# EAGLE design 7segement4digits1badidea-many-digits-mk-2 (EAGLE 6.5.0)
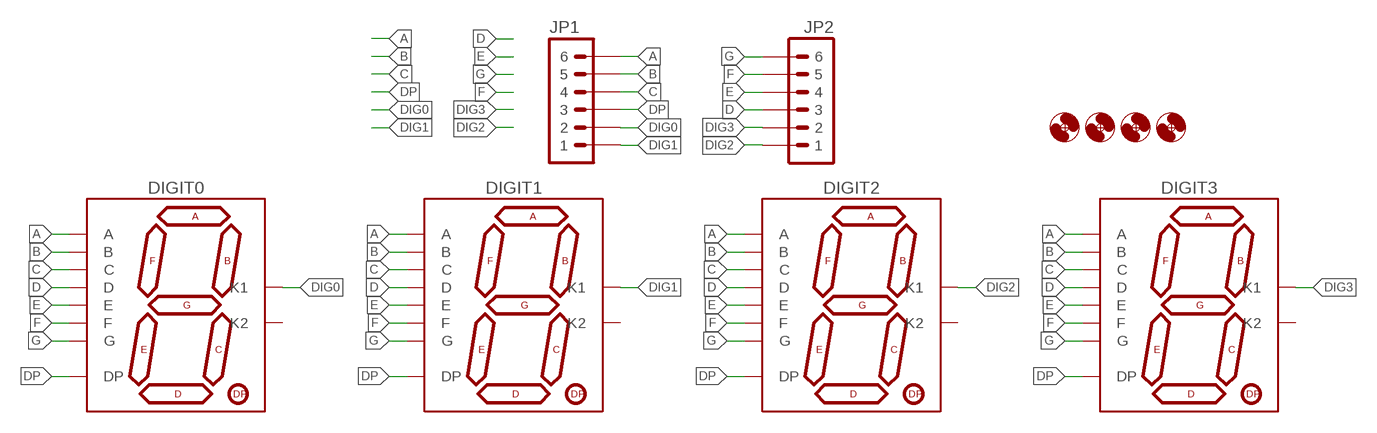
[diagram p0: schematic, sheet 1]

## Parts
DIGIT0  7SEG_1DIGPTH-25.4MM  [7SEG_1DIG_25.4MM]
DIGIT1  7SEG_1DIGPTH-25.4MM  [7SEG_1DIG_25.4MM]
DIGIT2  7SEG_1DIGPTH-25.4MM  [7SEG_1DIG_25.4MM]
DIGIT3  7SEG_1DIGPTH-25.4MM  [7SEG_1DIG_25.4MM]
H1  HOLE#2  [HOLE-#2]
H2  HOLE#2  [HOLE-#2]
H3  HOLE#2  [HOLE-#2]
H4  HOLE#2  [HOLE-#2]
JP1  M06-NOBS-PTH  [1X06_NOLOCK_FUCKITALL]
JP2  M06-NOBS-PTH  [1X06_NOLOCK_FUCKITALL]

## Nets
A: DIGIT0.7(A) DIGIT1.7(A) DIGIT2.7(A) DIGIT3.7(A) JP1.6
B: DIGIT0.6(B) DIGIT1.6(B) DIGIT2.6(B) DIGIT3.6(B) JP1.5
C: DIGIT0.4(C) DIGIT1.4(C) DIGIT2.4(C) DIGIT3.4(C) JP1.4
D: DIGIT0.2(D) DIGIT1.2(D) DIGIT2.2(D) DIGIT3.2(D) JP2.3
DIG0: DIGIT0.3(K1) JP1.2
DIG1: DIGIT1.3(K1) JP1.1
DIG2: DIGIT2.3(K1) JP2.1
DIG3: DIGIT3.3(K1) JP2.2
DP: DIGIT0.5(DP) DIGIT1.5(DP) DIGIT2.5(DP) DIGIT3.5(DP) JP1.3
E: DIGIT0.1(E) DIGIT1.1(E) DIGIT2.1(E) DIGIT3.1(E) JP2.4
F: DIGIT0.9(F) DIGIT1.9(F) DIGIT2.9(F) DIGIT3.9(F) JP2.5
G: DIGIT0.10(G) DIGIT1.10(G) DIGIT2.10(G) DIGIT3.10(G) JP2.6
Unconnected: DIGIT0.8(K2) DIGIT1.8(K2) DIGIT2.8(K2) DIGIT3.8(K2)

## Library data of the parts
DIGIT0 DIGIT1-DIGIT3 = A_butts:7SEG_1DIG
H1-H4 = A_butts:HOLE: MOUNTING HOLE with drill center marker
JP1 JP2 = A_butts:M06: Header 6 Standard 6-pin 0.1" header. Use with straight break away headers (SKU : PRT-00116), right angle break away headers (PRT-00553), swiss pins (PRT-00743), machine pins (PRT-00117), and female headers (PRT-00115). Molex polarized connector foot print use with SKU : PRT-08094 with associated crimp pins and housings. NOTES ON THE VARIANTS LOCK and LOCK_LONGPADS... This footprint was designed to help hold the alignment of a through-hole component (i.e. 6-pin header) while soldering it into place. You may notice that each hole has been shifted either up or down by 0.005 of an inch from it's more standard position (which is a perfectly straight line). This slight alteration caused the pins (the squares in the middle) to touch the edges of the holes. Because they are alternating, it causes a "brace" to hold the component in place. 0.005 has proven to be the perfect amount of "off-center" position when using our standard breakaway headers. Although looks a little odd when you look at the bare footprint, once you have a header in there, the alteration is very hard to notice. Also,if you push a header all the way into place, it is covered up entirely on the bottom side. This idea of altering the position of holes to aid alignment will be further integrated into the Sparkfun Library for other footprints. It can help hold any component with 3 or more connection pins.

## Board
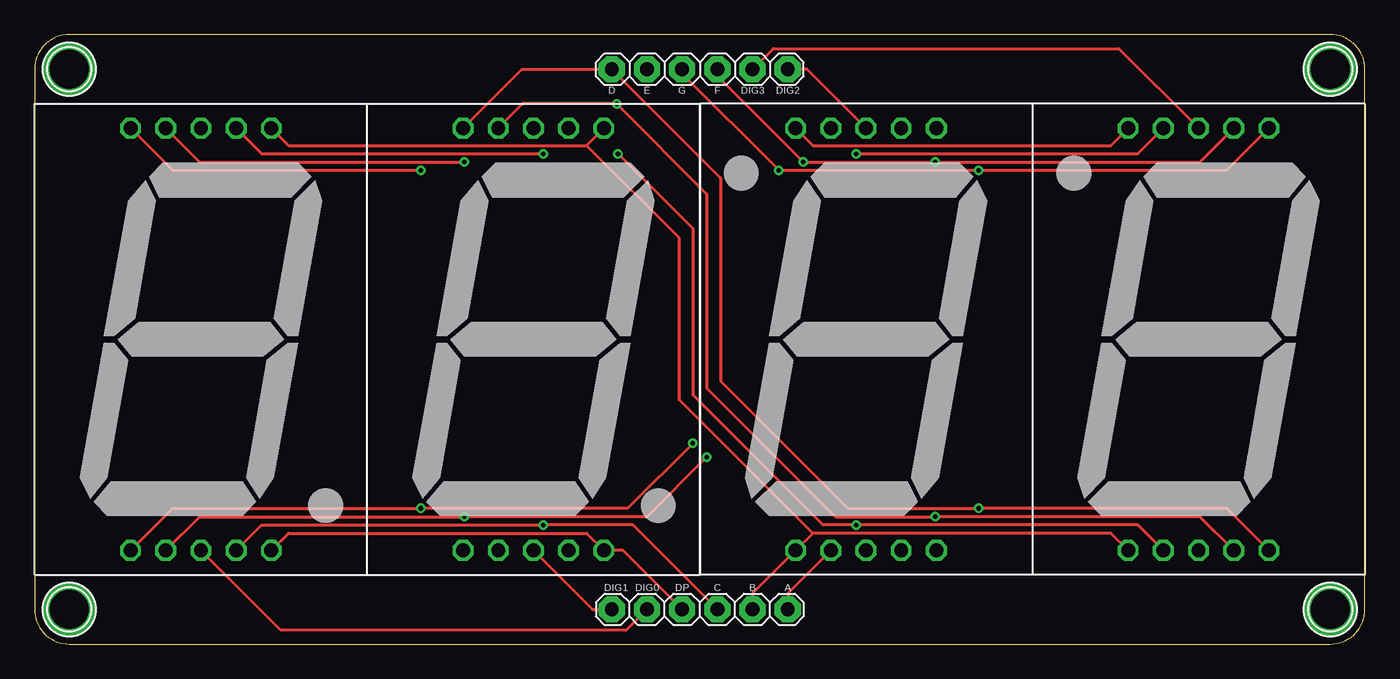
[diagram p1: board, top side]
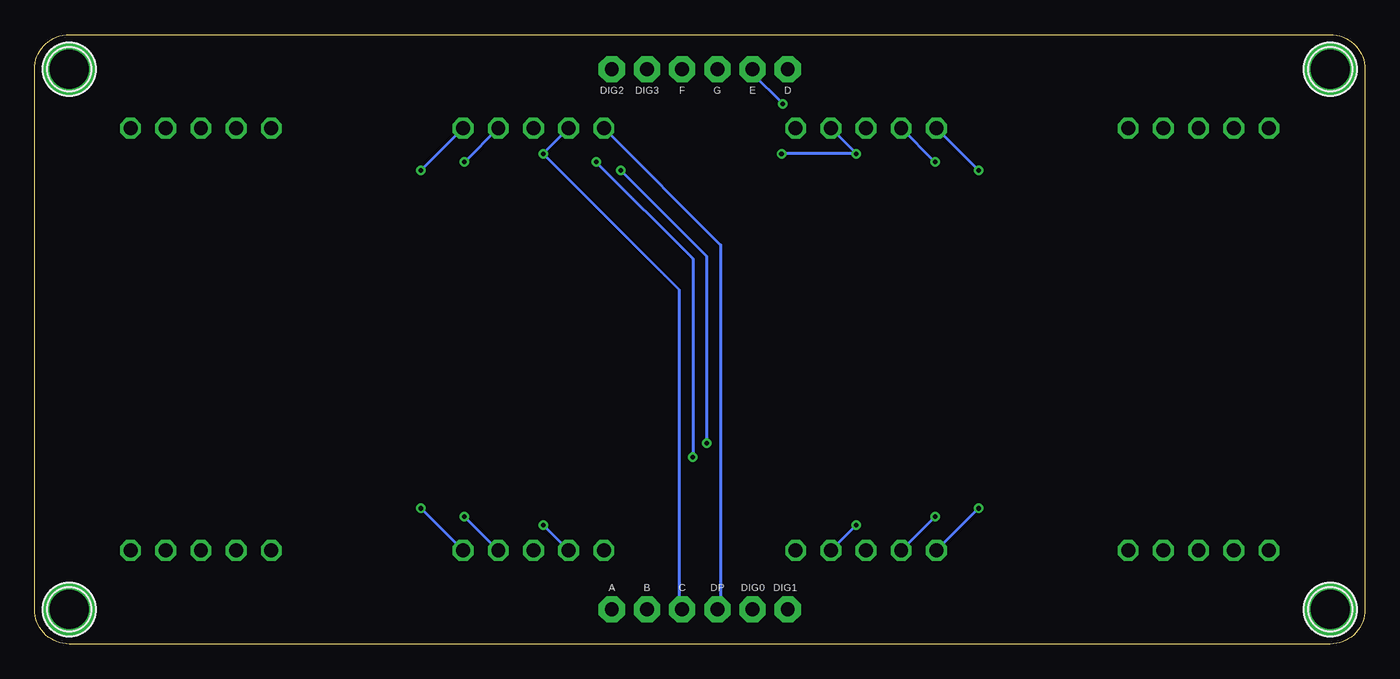
[diagram p2: board, bottom side, seen from below]

Size 96 x 44 mm. Coordinates in mm from the lower left corner, seen from the top.
Outline: 2.5,0 93.5,0 arc90 96,2.5 96,41.5 arc90 93.5,44 2.5,44 arc90 0,41.5 0,2.5 arc90 2.5,0
Copper layers (1*16): Top 0.0356mm / dielectric 1.5011mm / Bottom 0.0356mm
Design rules "LaenPCBOrder_2": minimum track width 6mil, minimum drill 13mil, track to track 6mil, track to pad 6mil, pad to pad 6mil, via to via 6mil, smd to smd 6mil, copper to edge 15mil, drill to drill 6mil, minimum pad ring 7mil, minimum via ring 7mil, stop-mask expansion 3mil, vias tented up to drill 20mil, thermal gap 10mil

### Footprints (pad centres in the part's own frame; a part is rotated, then mirrored left to right if it is on the bottom)
7SEG_1DIG_25.4MM = drill 1 pad 1.5 octagon: 1 -5.08,-15.24; 2 -2.54,-15.24; 3 0,-15.24; 4 2.54,-15.24; 5 5.08,-15.24; 6 5.08,15.24; 7 2.54,15.24; 8 0,15.24; 9 -2.54,15.24; 10 -5.08,15.24
HOLE-#2 = drill 2.8 pad 3.81: P$1 0,0
1X06_NOLOCK_FUCKITALL = drill 1 pad 1.88 octagon: 1 0,0; 2 2.54,0; 3 5.08,0; 4 7.62,0; 5 10.16,0; 6 12.7,0

### Placement (x,y rotation side)
DIGIT0  12,22 0 top
DIGIT1  36,22 0 top
DIGIT2  60,22 180 top
DIGIT3  84,22 180 top
H1  2.5,2.5 0 top
H2  2.5,41.5 0 top
H3  93.5,41.5 0 top
H4  93.5,2.5 0 top
JP1  41.65,2.5 0 top
JP2  54.35,41.5 180 top

### Tracks (layer width: path | path; a pad name or v marks a point on that pad's centre or on a via)
A  (via drill 0.33)
  Top 0.2: DIGIT0.7 16.38,35.4 v36.7,35.4 | DIGIT3.7 79.62,8.6 v59.3,8.6 56.9,8.6 47.5,18 47.5,30 v42.1,35.4 | DIGIT2.7 54.35,3.65 JP1.6
  Bottom 0.2: DIGIT1.7 v36.7,35.4 v42.1,35.4 | v59.3,8.6 DIGIT2.7
B
  Top 0.2: DIGIT0.6 18.32,36 39.84,36 | 39.84,36 DIGIT1.6 | DIGIT3.6 77.68,8 56.16,8 | JP1.5 51.81,3.65 DIGIT2.6 56.16,8 | 39.84,36 46.5,29.34 46.5,17.66 56.16,8
C  (via drill 0.33)
  Top 0.2: DIGIT0.4 16.38,8.6 v36.7,8.6 43.17,8.6 JP1.4 | v59.3,35.4 79.62,35.4 DIGIT3.4
  Bottom 0.2: v36.7,8.6 DIGIT1.4 | DIGIT2.4 v59.3,35.4 49.5,25.6 49.5,2.73 JP1.4
D  (via drill 0.33)
  Top 0.2: DIGIT0.2 11.9,9.2 v31.02,9.2 44.2,9.2 v48.5,13.5 | DIGIT3.2 84.1,34.8 v64.98,34.8 v55.47,34.8 49.27,41 JP2.3
  Bottom 0.2: v31.02,9.2 DIGIT1.2 | DIGIT2.2 v64.98,34.8 | v55.47,34.8 48.5,27.83 v48.5,13.5
DIG0
  Top 0.2: JP1.2 42.69,1 17.76,1 DIGIT0.3
DIG1
  Top 0.2: DIGIT1.3 40.26,2.5 JP1.1
DIG2
  Top 0.2: DIGIT2.3 55.74,41.5 JP2.1
DIG3
  Top 0.2: DIGIT3.3 78.24,43 53.31,43 JP2.2
DP
  Top 0.2: DIGIT0.5 18.32,8 39.84,8 DIGIT1.5 42.47,6.76 JP1.3 | DIGIT3.5 77.68,36 56.16,36 DIGIT2.5
  Bottom 0.2: DIGIT2.5 46.5,28.82 46.5,2.73 JP1.3
E  (via drill 0.33)
  Top 0.2: DIGIT0.1 9.96,9.8 v27.88,9.8 42.8,9.8 v47.5,14.5 | DIGIT3.1 86.04,34.2 v68.12,34.2 v53.7,34.2 46.73,41.17 JP2.4
  Bottom 0.2: v27.88,9.8 DIGIT1.1 | DIGIT2.1 v68.12,34.2 | v53.7,34.2 47.5,28 v47.5,14.5
F  (via drill 0.33)
  Top 0.2: DIGIT0.9 11.9,34.8 v31.02,34.8 | DIGIT3.9 84.1,9.2 v64.98,9.2 57.8,9.2 48.5,18.5 48.5,32.5 v42,39 35.22,39 DIGIT1.9
  Bottom 0.2: v64.98,9.2 DIGIT2.9 | v31.02,34.8 DIGIT1.9 | v42,39 44.19,41.19 JP2.5
G  (via drill 0.33)
  Top 0.2: DIGIT0.10 9.96,34.2 v27.88,34.2 | DIGIT3.10 86.04,9.8 v68.12,9.8 58.7,9.8 49.5,19 49.5,33.65 JP2.6 35.18,41.5 DIGIT1.10
  Bottom 0.2: v68.12,9.8 DIGIT2.10 | v27.88,34.2 DIGIT1.10

### Text on the board
tPlace: D | E | G | F | DIG3 | DIG2 | DIG1 | DIG0 | DP | C | B | A
bPlace: D | E | G | F | DIG3 | DIG2 | DIG1 | DIG0 | DP | C | B | A